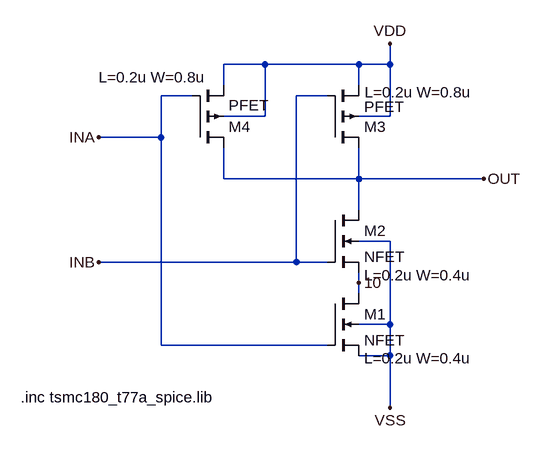
[diagram p0: schematic NAND.asc]
NAND.asc, the LTspice schematic file:
Version 4
SHEET 1 880 680
WIRE 144 -208 80 -208
WIRE 288 -208 144 -208
WIRE 336 -208 336 -240
WIRE 336 -208 288 -208
WIRE 80 -176 80 -208
WIRE 288 -176 288 -208
WIRE 32 -160 -16 -160
WIRE 240 -160 192 -160
WIRE 144 -128 144 -208
WIRE 144 -128 80 -128
WIRE 336 -128 336 -208
WIRE 336 -128 288 -128
WIRE -16 -96 -16 -160
WIRE -16 -96 -112 -96
WIRE 80 -32 80 -80
WIRE 288 -32 288 -80
WIRE 288 -32 80 -32
WIRE 480 -32 288 -32
WIRE 288 16 288 -32
WIRE 336 64 288 64
WIRE 192 96 192 -160
WIRE 192 96 -112 96
WIRE 240 96 192 96
WIRE 288 128 288 112
WIRE 288 144 288 128
WIRE 336 192 336 64
WIRE 336 192 288 192
WIRE -16 224 -16 -96
WIRE 240 224 -16 224
WIRE 336 240 336 192
WIRE 336 240 288 240
WIRE 336 320 336 240
FLAG 336 -240 VDD
FLAG 480 -32 OUT
FLAG -112 -96 INA
FLAG -112 96 INB
FLAG 336 320 VSS
FLAG 288 128 10
SYMBOL nmos4 240 144 R0
WINDOW 123 56 100 Left 2
SYMATTR Value2 L=0.2u W=0.4u
SYMATTR InstName M1
SYMATTR Value NFET
SYMBOL nmos4 240 16 R0
WINDOW 123 56 100 Left 2
SYMATTR Value2 L=0.2u W=0.4u
SYMATTR InstName M2
SYMATTR Value NFET
SYMBOL pmos4 240 -80 M180
WINDOW 3 56 63 Left 2
WINDOW 123 57 85 Left 2
SYMATTR Value PFET
SYMATTR Value2 L=0.2u W=0.8u
SYMATTR InstName M3
SYMBOL pmos4 32 -80 M180
WINDOW 3 56 65 Left 2
WINDOW 123 -144 108 Left 2
SYMATTR Value PFET
SYMATTR Value2 L=0.2u W=0.8u
SYMATTR InstName M4
TEXT -232 304 Left 2 !.inc tsmc180_t77a_spice.lib

The netlist it stands for:
* NAND.asc
M1 10 INA VSS VSS NFET L=0.2u W=0.4u
M2 OUT INB 10 VSS NFET L=0.2u W=0.4u
M3 OUT INB VDD VDD PFET L=0.2u W=0.8u
M4 OUT INA VDD VDD PFET L=0.2u W=0.8u
.model NMOS NMOS
.model PMOS PMOS
.lib standard.mos
.inc tsmc180_t77a_spice.lib
.backanno
.end